# EAGLE design pc_openpressure_basic (EAGLE 6.4)
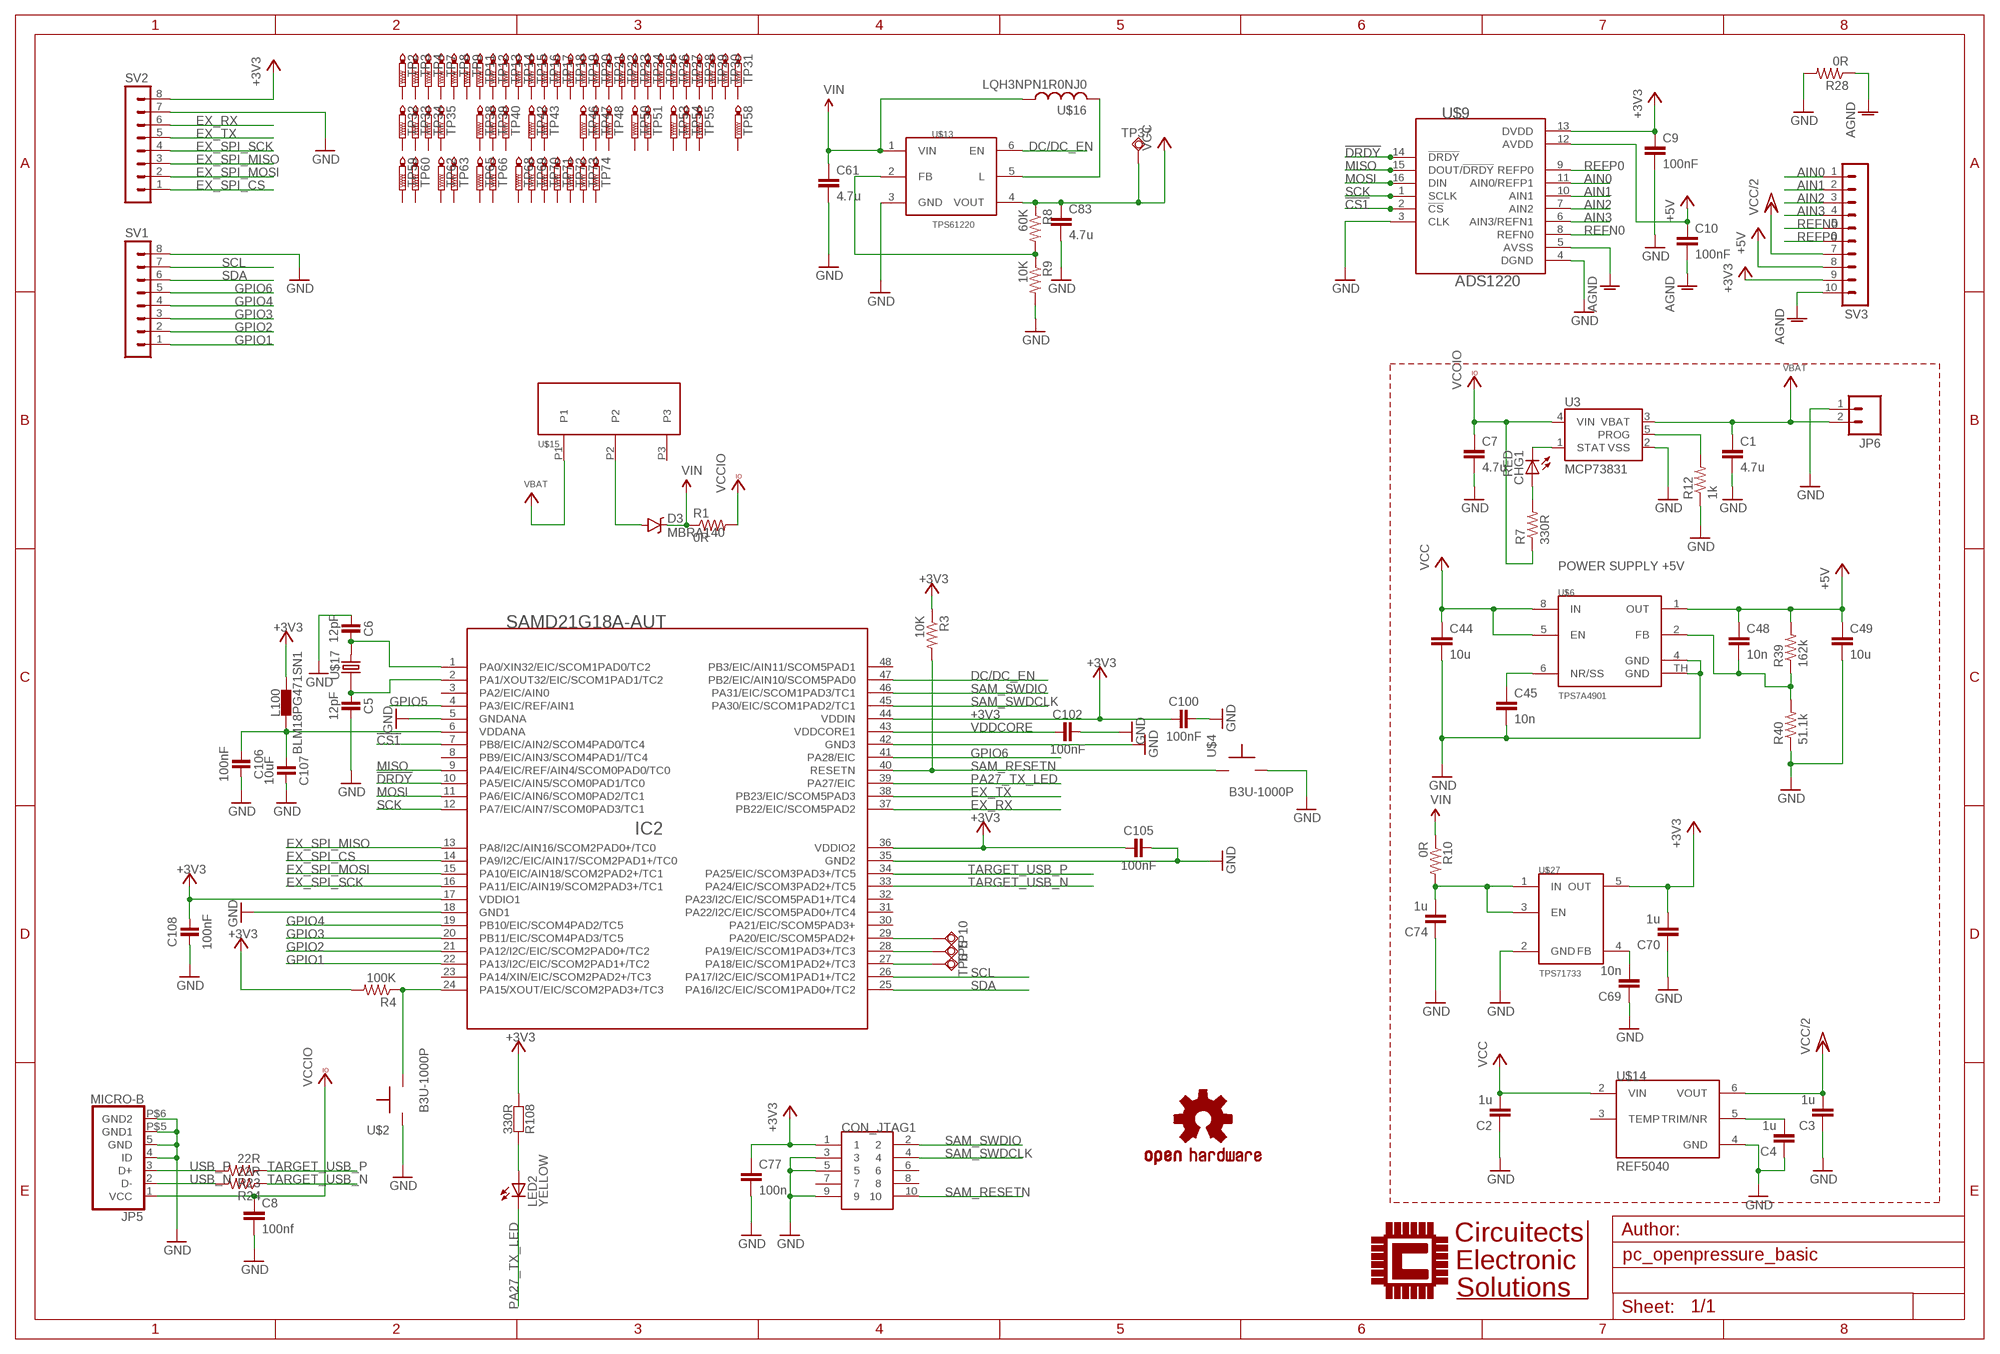
[diagram p0: schematic, sheet 1]

## Parts
C1  4.7u  C-EUC0805  [C0805]
C2  1u  C-EUC0805  [C0805]
C3  1u  C-EUC0805  [C0805]
C4  1u  C-EUC0805  [C0805]
C5  12pF  CAPACITORS-0402  [C0402]
C6  12pF  CAPACITORS-0402  [C0402]
C7  4.7u  C-EUC0805  [C0805]
C8  100nf  C-EUC0805  [C0805]
C9  100nF  C-EUC0805  [C0805]
C10  100nF  C-EUC0805  [C0805]
C44  10u  C-EUC0805  [C0805]
C45  10n  C-EUC0402  [C0402]
C48  10n  C-EUC0402  [C0402]
C49  10u  C-EUC0805  [C0805]
C61  4.7u  C-EUC0805  [C0805]
C69  10n  C-EUC0402  [C0402]
C70  1u  C-EUC0805  [C0805]
C74  1u  C-EUC0805  [C0805]
C77  100n  C-EUC0805  [C0805]
C83  4.7u  C-EUC0805  [C0805]
C100  100nF  CAPACITORS-0805  [C0805]
C102  100nF  CAPACITORS-0805  [C0805]
C105  100nF  CAPACITORS-0805  [C0805]
C106  100nF  CAPACITORS-0805  [C0805]
C107  10uF  CAPACITORS-0805  [C0805]
C108  100nF  CAPACITORS-0805  [C0805]
CHG1  RED  LEDCHIPLED_0603  [CHIPLED_0603]
CON_JTAG1  HDR-SMT-50MIL/5X2  [HDR-SMT-50MIL/5X2]
D3  MBRA140  DIODE-SCHOTTKY-MBRA140  [SMA-DIODE]
IC2  SAMD21G18A-AUT  SAMD21G18A  [TQFP48]
JP5  MICRO-B  [MICRO-B]
JP6  M02-JST-2MM-SMT  [JST-2-SMD]
L100  BLM18PG471SN1  INDUCTOR-0603  [C0603]
LED2  YELLOW  LEDCHIPLED_0603  [CHIPLED_0603]
R1  0R  R-US_R0402  [R0402]
R3  10K  R-US_R0805  [R0805]
R4  100K  R-US_R0402  [R0402]
R7  330R  R-US_R0805  [R0805]
R8  60K  R-US_R0805  [R0805]
R9  10K  R-US_R0805  [R0805]
R10  0R  R-US_R0402  [R0402]
R12  1k  R-US_R0805  [R0805]
R23  22R  R-US_R0402  [R0402]
R24  22R  R-US_R0402  [R0402]
R28  0R  R-US_R0805  [R0805]
R39  162k  R-US_R0805  [R0805]
R40  51.1k  R-US_R0805  [R0805]
R108  330R  RESISTORS-0402  [C0402]
SV1  MA08-1  [MA08-1]
SV2  MA08-1  [MA08-1]
SV3  MA10-1  [MA10-1]
TP2  PTR1PAD1-13  [P1-13]
TP3  PTR1PAD1-13  [P1-13]
TP4  PTR1PAD1-13  [P1-13]
TP5  TPSQB1,27  [B1,27]
TP6  TPSQB1,27  [B1,27]
TP7  PTR1PAD1-13  [P1-13]
TP8  PTR1PAD1-13  [P1-13]
TP9  PTR1PAD1-13  [P1-13]
TP10  TPSQB1,27  [B1,27]
TP11  PTR1PAD1-13  [P1-13]
TP12  PTR1PAD1-13  [P1-13]
TP13  PTR1PAD1-13  [P1-13]
TP14  PTR1PAD1-13  [P1-13]
TP15  PTR1PAD1-13  [P1-13]
TP16  PTR1PAD1-13  [P1-13]
TP17  PTR1PAD1-13  [P1-13]
TP18  PTR1PAD1-13  [P1-13]
TP19  PTR1PAD1-13  [P1-13]
TP20  PTR1PAD1-13  [P1-13]
TP21  PTR1PAD1-13  [P1-13]
TP22  PTR1PAD1-13  [P1-13]
TP23  PTR1PAD1-13  [P1-13]
TP24  PTR1PAD1-13  [P1-13]
TP25  PTR1PAD1-13  [P1-13]
TP26  PTR1PAD1-13  [P1-13]
TP27  PTR1PAD1-13  [P1-13]
TP28  PTR1PAD1-13  [P1-13]
TP29  PTR1PAD1-13  [P1-13]
TP30  PTR1PAD1-13  [P1-13]
TP31  PTR1PAD1-13  [P1-13]
TP32  PTR1PAD1-13  [P1-13]
TP33  PTR1PAD1-13  [P1-13]
TP34  PTR1PAD1-13  [P1-13]
TP35  PTR1PAD1-13  [P1-13]
TP37  TPSQB1,27  [B1,27]
TP38  PTR1PAD1-13  [P1-13]
TP39  PTR1PAD1-13  [P1-13]
TP40  PTR1PAD1-13  [P1-13]
TP42  PTR1PAD1-13  [P1-13]
TP43  PTR1PAD1-13  [P1-13]
TP46  PTR1PAD1-13  [P1-13]
TP47  PTR1PAD1-13  [P1-13]
TP48  PTR1PAD1-13  [P1-13]
TP50  PTR1PAD1-13  [P1-13]
TP51  PTR1PAD1-13  [P1-13]
TP53  PTR1PAD1-13  [P1-13]
TP54  PTR1PAD1-13  [P1-13]
TP55  PTR1PAD1-13  [P1-13]
TP58  PTR1PAD1-13  [P1-13]
TP59  PTR1PAD1-13  [P1-13]
TP60  PTR1PAD1-13  [P1-13]
TP62  PTR1PAD1-13  [P1-13]
TP63  PTR1PAD1-13  [P1-13]
TP65  PTR1PAD1-13  [P1-13]
TP66  PTR1PAD1-13  [P1-13]
TP68  PTR1PAD1-13  [P1-13]
TP69  PTR1PAD1-13  [P1-13]
TP70  PTR1PAD1-13  [P1-13]
TP71  PTR1PAD1-13  [P1-13]
TP72  PTR1PAD1-13  [P1-13]
TP73  PTR1PAD1-13  [P1-13]
TP74  PTR1PAD1-13  [P1-13]
U3  MCP73831  [SOT23-5]
U$2  B3U-1000P  [B3U-1000P]
U$4  B3U-1000P  [B3U-1000P]
U$6  TPS7A4901  [S-PDSO-G08]
U$7  CES-LOGO  [CES-LOGO-SMALL]
U$8  PROTY-LOGO  [LOGO-PROTY]
U$9  ADS1220  [TSSOP-16]
U$13  TPS61220  TPS61222  [SC-70-6]
U$14  REF5040  [SO-08M]
U$15  PCM12SMTR  [PCM12SMTR]
U$16  LQH3NPN1R0NJ0  [LQH3NP]
U$17  ECS-X-34B  [ECX-31B]
U$18  PROTY_LOGO_WITH_TEXT  [PROTY_WITH_TEXT]
U$19  OSHW-LOGOM  [OSHW-LOGO-M]
U$27  TPS71733  TPS717XX  [SC70-5]

## Nets
!CS1: IC2.7(PB8/EIC/AIN2/SCOM4PAD0/TC4) U$9.2(!CS)
!DRDY: IC2.10(PA5/EIC/AIN5/SCOM0PAD1/TC0) U$9.14(!DRDY)
+3V3: C9.1 C70.2 C77.1 C100.1 C105.1 C108.2 CON_JTAG1.1 IC2.17(VDDIO1) IC2.36(VDDIO2) IC2.44(VDDIN) L100.2 R3.1 R4.2 R108.1 SV2.8 SV3.9 U$9.13(DVDD) U$27.5(OUT)
+5V: C10.1 C48.1 C49.1 R39.2 SV3.8 U$6.1(OUT) U$9.12(AVDD)
AGND: C10.2 R28.1 SV3.10 U$9.5(AVSS)
AIN0: SV3.1 U$9.11(AIN0/REFP1)
AIN1: SV3.2 U$9.10(AIN1)
AIN2: SV3.3 U$9.7(AIN2)
AIN3: SV3.4 U$9.6(AIN3/REFN1)
DC/DC_EN: IC2.47(PB2/EIC/AIN10/SCOM5PAD0) U$13.6(EN)
EX_RX: IC2.37(PB22/EIC/SCOM5PAD2) SV2.6
EX_SPI_CS: IC2.14(PA9/I2C/EIC/AIN17/SCOM2PAD1+/TC0) SV2.1
EX_SPI_MISO: IC2.13(PA8/I2C/AIN16/SCOM2PAD0+/TC0) SV2.3
EX_SPI_MOSI: IC2.15(PA10/EIC/AIN18/SCOM2PAD2+/TC1) SV2.2
EX_SPI_SCK: IC2.16(PA11/EIC/AIN19/SCOM2PAD3+/TC1) SV2.4
EX_TX: IC2.38(PB23/EIC/SCOM5PAD3) SV2.5
GND [gnd]: C1.2 C2.1 C3.1 C4.1 C5.2 C6.1 C7.2 C8.2 C9.2 C44.2 C45.2 C49.2 C61.2 C69.1 C70.1 C74.1 C77.2 C83.2 C100.2 C102.2 C105.2 C106.2 C107.2 C108.1 CON_JTAG1.3 CON_JTAG1.5 CON_JTAG1.9 IC2.5(GNDANA) IC2.18(GND1) IC2.35(GND2) IC2.42(GND3) JP5.4(ID) JP5.5(GND) JP5.P$5(GND1) JP5.P$6(GND2) JP6.1 R9.2 R12.1 R28.2 R40.1 SV1.8 SV2.7 U3.2(VSS) U$2.P$1 U$4.P$2 U$6.4(GND) U$6.TH(GND) U$9.3(CLK) U$9.4(DGND) U$13.3(GND) U$14.4(GND) U$27.2(GND)
GPIO1: IC2.22(PA13/I2C/EIC/SCOM2PAD1+/TC2) SV1.1
GPIO2: IC2.21(PA12/I2C/EIC/SCOM2PAD0+/TC2) SV1.2
GPIO3: IC2.20(PB11/EIC/SCOM4PAD3/TC5) SV1.3
GPIO4: IC2.19(PB10/EIC/SCOM4PAD2/TC5) SV1.4
GPIO5: IC2.4(PA3/EIC/REF/AIN1)
GPIO6: IC2.41(PA28/EIC) SV1.5
MISO: IC2.9(PA4/EIC/REF/AIN4/SCOM0PAD0/TC0) U$9.15(DOUT/!DRDY)
MOSI: IC2.11(PA6/EIC/AIN6/SCOM0PAD2/TC1) U$9.16(DIN)
N$1: C6.2 IC2.1(PA0/XIN32/EIC/SCOM1PAD0/TC2) U$17.P$2
N$2: C74.2 R10.2 U$27.1(IN) U$27.3(EN)
N$4: D3.A U$15.P2
N$5: R8.2 R9.1 U$13.2(FB)
N$6: IC2.24(PA15/XOUT/EIC/SCOM2PAD3+/TC3) R4.1 U$2.P$2
N$7: C5.1 IC2.2(PA1/XOUT32/EIC/SCOM1PAD1/TC2) U$17.P$1
N$10: C106.1 C107.1 IC2.6(VDDANA) L100.1
N$11: IC2.27(PA18/EIC/SCOM1PAD2+/TC3) TP6.TP
N$14: CHG1.C U3.1(STAT)
N$15: CHG1.A R7.2
N$16: C45.1 U$6.6(NR/SS)
N$17: IC2.28(PA19/EIC/SCOM1PAD3+/TC3) TP5.TP
N$18: IC2.29(PA20/EIC/SCOM5PAD2+) TP10.TP
N$19: R12.2 U3.5(PROG)
N$20: LED2.A R108.2
N$21: C48.2 R39.1 R40.2 U$6.2(FB)
N$24: C4.2 U$14.5(TRIM/NR)
N$39: U$13.5(L) U$16.P$2
N$70: C69.2 U$27.4(FB)
PA27_TX_LED: IC2.39(PA27/EIC) LED2.C
REFN0: SV3.5 U$9.8(REFN0)
REFP0: SV3.6 U$9.9(REFP0)
SAM_RESETN: CON_JTAG1.10 IC2.40(RESETN) R3.2 U$4.P$1
SAM_SWDCLK: CON_JTAG1.4 IC2.45(PA30/EIC/SCOM1PAD2/TC1)
SAM_SWDIO: CON_JTAG1.2 IC2.46(PA31/EIC/SCOM1PAD3/TC1)
SCK: IC2.12(PA7/EIC/AIN7/SCOM0PAD3/TC1) U$9.1(SCLK)
SCL: IC2.26(PA17/I2C/EIC/SCOM1PAD1+/TC2) SV1.7
SDA: IC2.25(PA16/I2C/EIC/SCOM1PAD0+/TC2) SV1.6
TARGET_USB_N [USBpair]: IC2.33(PA24/EIC/SCOM3PAD2+/TC5) R24.1
TARGET_USB_P [USBpair]: IC2.34(PA25/EIC/SCOM3PAD3+/TC5) R23.1
USB_N [USBpair]: JP5.2(D-) R24.2
USB_P [USBpair]: JP5.3(D+) R23.2
VBAT: C1.1 JP6.2 U3.3(VBAT) U$15.P1
VCC: C2.2 C44.1 C83.1 R8.1 TP37.TP U$6.5(EN) U$6.8(IN) U$13.4(VOUT) U$14.2(VIN)
VCC/2: C3.2 SV3.7 U$14.6(VOUT)
VCCIO: C7.1 C8.1 JP5.1(VCC) R1.2 R7.1 U3.4(VIN)
VDDCORE: C102.1 IC2.43(VDDCORE1)
VIN: C61.1 D3.C R1.1 R10.1 U$13.1(VIN) U$16.P$1
Unconnected: CON_JTAG1.6 CON_JTAG1.7 CON_JTAG1.8 IC2.3(PA2/EIC/AIN0) IC2.8(PB9/EIC/AIN3/SCOM4PAD1//TC4) IC2.23(PA14/XIN/EIC/SCOM2PAD2+/TC3) IC2.30(PA21/EIC/SCOM5PAD3+) IC2.31(PA22/I2C/EIC/SCOM5PAD0+/TC4) IC2.32(PA23/I2C/EIC/SCOM5PAD1+/TC4) IC2.48(PB3/EIC/AIN11/SCOM5PAD1) TP2.TP TP3.TP TP4.TP TP7.TP TP8.TP TP9.TP TP11.TP TP12.TP TP13.TP TP14.TP TP15.TP TP16.TP TP17.TP TP18.TP TP19.TP TP20.TP TP21.TP TP22.TP TP23.TP TP24.TP TP25.TP TP26.TP TP27.TP TP28.TP TP29.TP TP30.TP TP31.TP TP32.TP TP33.TP TP34.TP TP35.TP TP38.TP TP39.TP TP40.TP TP42.TP TP43.TP TP46.TP TP47.TP TP48.TP TP50.TP TP51.TP TP53.TP TP54.TP TP55.TP TP58.TP TP59.TP TP60.TP TP62.TP TP63.TP TP65.TP TP66.TP TP68.TP TP69.TP TP70.TP TP71.TP TP72.TP TP73.TP TP74.TP U$14.3(TEMP) U$15.P3

## Notes on the sheet
- POWER SUPPLY +5V

## Library data of the parts
C1-C4 C7-C10 C44 C45 C48 C49 C61 C69 C70 C74 C77 C83 = rcl:C-EU: CAPACITOR, European symbol
C5 C6 C100 C102 C105-C108 = Arduino:CAPACITORS: Capacitors ...4.7uF @ 6.3V -> 0402 ...10uF @ 16V -> 0603 ...22uF @ 25V -> 0805
CHG1 LED2 = led:LED: LED OSRAM: - CHIPLED LG R971, LG N971, LY N971, LG Q971, LY Q971, LO R971, LY R971 LH N974, LH R974 LS Q976, LO Q976, LY Q976 LO Q996 - Hyper CHIPLED LW Q18S LB Q993, LB Q99A, LB R99A - SideLED LS A670, LO A670, LY A670, LG A670, LP A670 LB A673, LV A673, LT A673, LW A673 LH A674 LY A675 LS A676, LA A676, LO A676, LY A676, LW A676 LS A679, LY A679, LG A679 - Hyper Micro SIDELED® LS Y876, LA Y876, LO Y876, LY Y876 LT Y87S - SmartLED LW L88C, LW L88S LB L89C, LB L89S, LG L890 LS L89K, LO L89K, LY L89K LS L896, LA L896, LO L896, LY L896 - TOPLED LS T670, LO T670, LY T670, LG T670, LP T670 LSG T670, LSP T670, LSY T670, LOP T670, LYG T670 LG T671, LOG T671, LSG T671 LB T673, LV T673, LT T673, LW T673 LH T674 LS T676, LA T676, LO T676, LY T676, LB T676, LH T676, LSB T676, LW T676 LB T67C, LV T67C, LT T67C, LS T67K, LO T67K, LY T67K, LW E67C LS E67B, LA E67B, LO E67B, LY E67B, LB E67C, LV E67C, LT E67C LW T67C LS T679, LY T679, LG T679 LS T770, LO T770, LY T770, LG T770, LP T770 LB T773, LV T773, LT T773, LW T773 LH T774 LS E675, LA E675, LY E675, LS T675 LS T776, LA T776, LO T776, LY T776, LB T776 LHGB T686 LT T68C, LB T68C - Hyper Mini TOPLED® LB M676 - Mini TOPLED Santana® LG M470 LS M47K, LO M47K, LY M47K Source: http://www.osram.convergy.de LUXEON: - LUMILED® LXK2-PW12-R00, LXK2-PW12-S00, LXK2-PW14-U00, LXK2-PW14-V00 LXK2-PM12-R00, LXK2-PM12-S00, LXK2-PM14-U00 LXK2-PE12-Q00, LXK2-PE12-R00, LXK2-PE12-S00, LXK2-PE14-T00, LXK2-PE14-U00 LXK2-PB12-K00, LXK2-PB12-L00, LXK2-PB12-M00, LXK2-PB14-N00, LXK2-PB14-P00, LXK2-PB14-Q00 LXK2-PR12-L00, LXK2-PR12-M00, LXK2-PR14-Q00, LXK2-PR14-R00 LXK2-PD12-Q00, LXK2-PD12-R00, LXK2-PD12-S00 LXK2-PH12-R00, LXK2-PH12-S00 LXK2-PL12-P00, LXK2-PL12-Q00, LXK2-PL12-R00 Source: www.luxeon.com KINGBRIGHT: KA-3528ASYC Source: www.kingbright.com
CON_JTAG1 = circuitects:HDR-SMT-50MIL/5X2
D3 = SparkFun-DiscreteSemi:DIODE-SCHOTTKY: Schottky diodes in SFE's production catalog BAT20J 1A 23V 0.62Vf RB751 120mA 40V 0.37Vf PMEG4005EJ 0.5A 40V 0.42Vf MBRA140 1A 40V 0.5Vf B340A 3A 40V SMA; PROD_ID: DIO-08053
IC2 = Arduino:SAMD21G18A: Atmel D21 32bit ARM Cortex-M0 microcontroller - 48 PIN TQFP 256KB flash memory + 32KB SRAM
JP5 = circuitects:MICRO-B
JP6 = SparkFun:M02: Header 2 Standard 2-pin 0.1" header. Use with straight break away headers (SKU : PRT-00116), right angle break away headers (PRT-00553), swiss pins (PRT-00743), machine pins (PRT-00117), and female headers (PRT-00115). Molex polarized connector foot print use with SKU : PRT-08233 with associated crimp pins and housings.
L100 = Arduino:INDUCTOR: Inductors
R1 R3 R4 R7-R10 R12 R23 R24 R28 R39 R40 = rcl:R-US_: RESISTOR, American symbol
R108 = Arduino:RESISTORS: Resistors all kinds in 0603 and 0402
SV1 SV2 = con-lstb:MA08-1: PIN HEADER; OC_FARNELL: unknown; OC_NEWARK: unknown
SV3 = con-lstb:MA10-1: PIN HEADER; OC_FARNELL: unknown; OC_NEWARK: unknown
TP2-TP4 TP7-TP9 TP11-TP35 TP38-TP40 TP42 TP43 TP46-TP48 TP50 TP51 TP53-TP55 TP58-TP60 TP62 TP63 TP65 TP66 TP68-TP74 = testpad:PTR1: TEST PIN
TP5 TP6 TP10 TP37 = testpad:TPSQ: Test pad
U3 = SparkFun:MCP73831: Microchip's MCP73831 Miniature single cell, fully integrated Li-Ion, Li-polymer charge management controller http://ww1.microchip.com/downloads/en/DeviceDoc/21984a.pdf
U$2 U$4 = circuitects:B3U-1000P
U$6 = circuitects:TPS7A4901
U$7 = circuitects:CES-LOGO
U$8 = circuitects:PROTY-LOGO
U$9 = circuitects:ADS1220
U$13 = circuitects:TPS61222
U$14 = circuitects:REF5040
U$15 = circuitects:PCM12SMTR
U$16 = circuitects:LQH3NPN1R0NJ0
U$17 = circuitects:ECS-X-34B
U$18 = circuitects:PROTY_LOGO_WITH_TEXT
U$19 = SparkFun:OSHW-LOGO: Open Source Hardware Logo This logo indicates the piece of hardware it is found on incorporates a OSHW license and/or adheres to the definition of open source hardware found here: http://freedomdefined.org/OSHW
U$27 = circuitects:TPS717XX

## Net classes
1 USB: width 0.102 mm, drill 0.1 mm
2 gnd: width 0.102 mm, drill 0.1 mm
3 usbvcc: width 0.102 mm, drill 0.1 mm, clearance 0.15 mm
4 USBpair: width 0.102 mm, drill 0.1 mm, clearance 0.15 mm to class 3

## Board
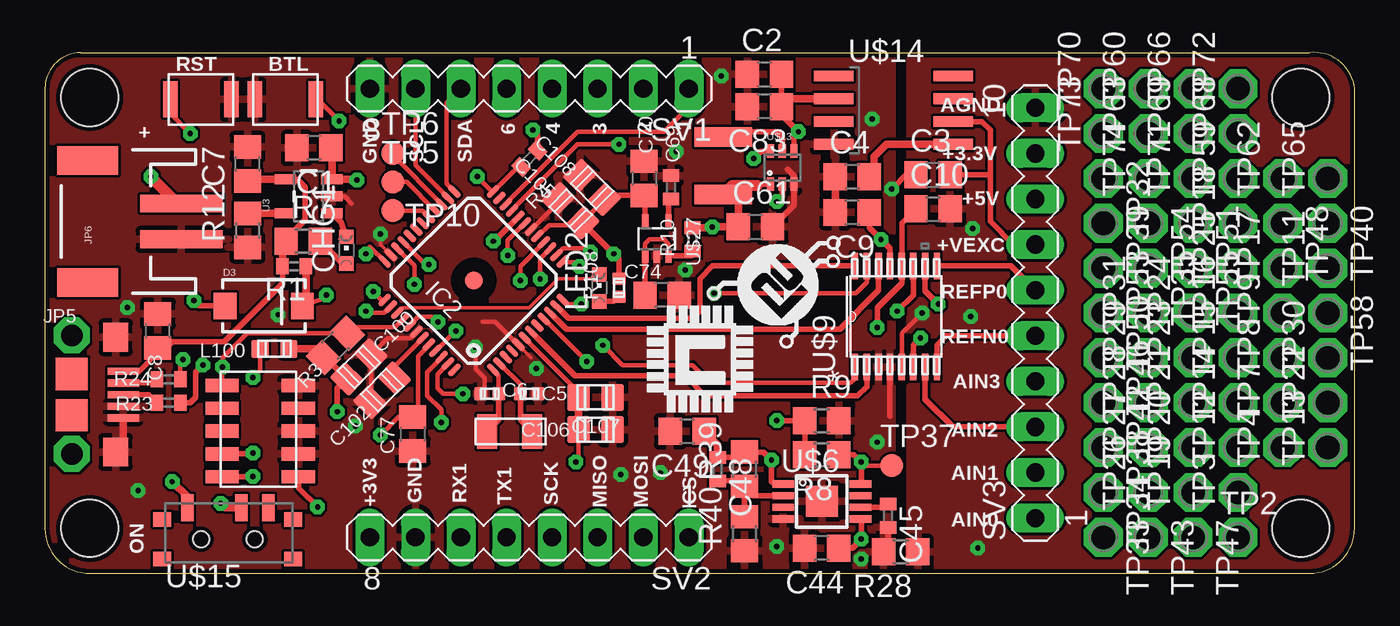
[diagram p1: board, top side]
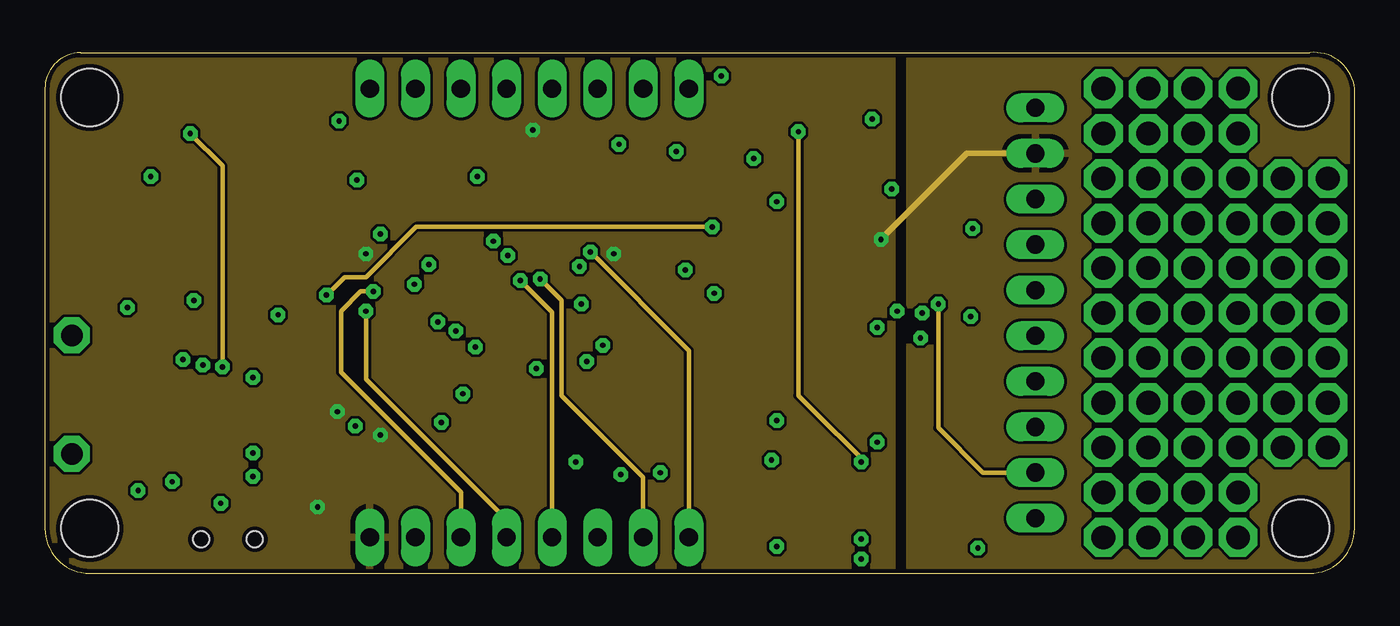
[diagram p2: board, inner layer Route2]
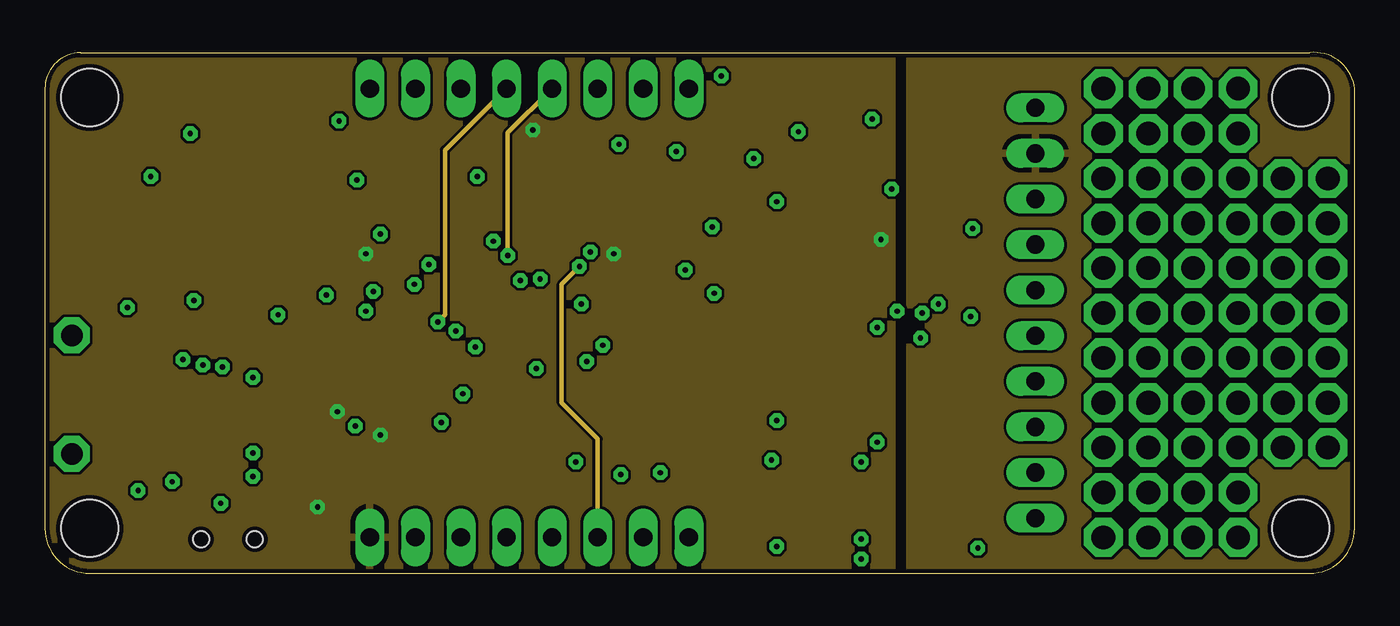
[diagram p3: board, inner layer Route15]
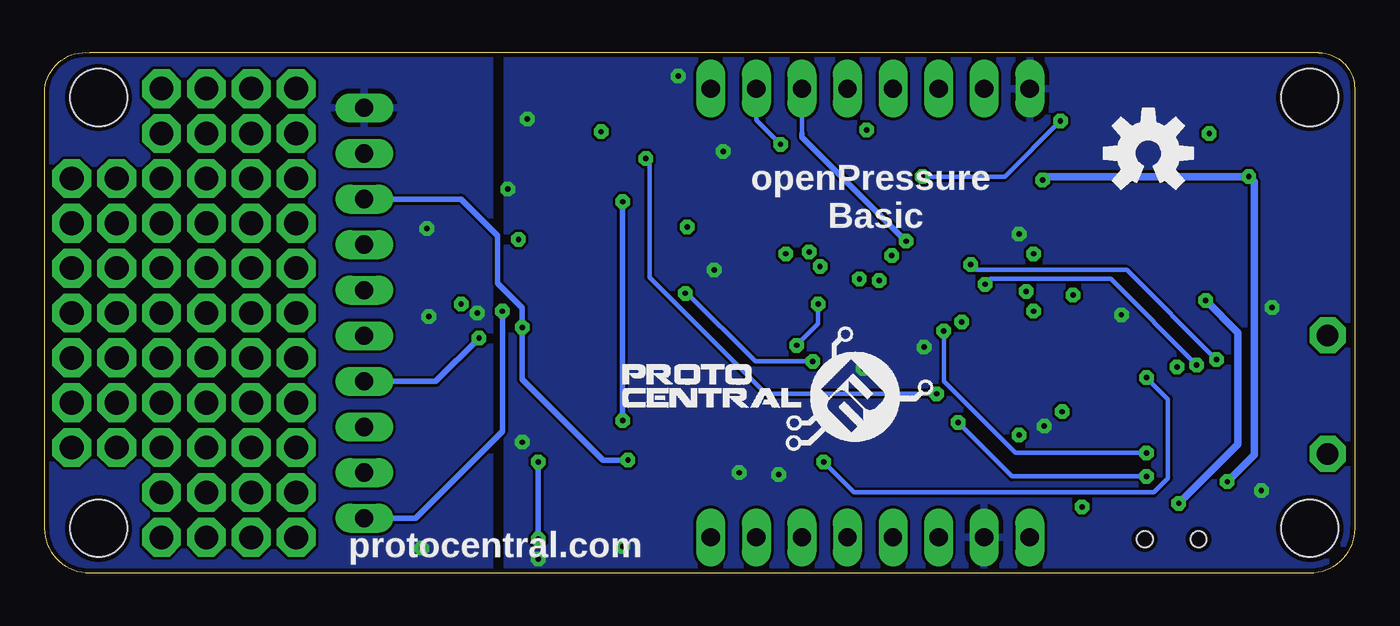
[diagram p4: board, bottom side, seen from below]

Size 73 x 29.01 mm. Coordinates in mm from the lower left corner, seen from the top.
Outline: 2.5,0 70.5,0 arc90 73,2.5 73,27 arc90 70.5,29 2,29 arc90 0,27 0,2.5 arc90 2.5,0
Copper layers (1*2*15*16): Top 0.035mm / dielectric 1.5mm / Route2 0.035mm / dielectric 0.15mm / Route15 0.035mm / dielectric 0.2mm / Bottom 0.035mm
Design rules "Circuitects-Rules": minimum track width 6mil, minimum drill 0.3mm, track to track 6mil, track to pad 6mil, pad to pad 6mil, via to via 6mil, smd to smd 6mil, copper to edge 10mil, drill to drill 8mil, minimum pad ring 12mil, minimum via ring 10mil, stop-mask expansion 4mil, vias tented up to drill 25mil, thermal gap 10mil
Holes 3.2 mm at 70,2.5 2.5,2.5 70,26.5 2.5,26.5

### Footprints (pad centres in the part's own frame; a part is rotated, then mirrored left to right if it is on the bottom)
C0805 = smd 1.3 x 1.5: 1 -0.95,0; 2 0.95,0
C0402 = smd 0.75 x 0.7: 1 0,0.5; 2 0,-0.5
C0402' = smd 0.7 x 0.9: 1 -0.65,0; 2 0.65,0
C0805' = smd 1.5 x 1.25: 1 0,0.95; 2 0,-0.95
CHIPLED_0603 = smd 0.8 x 0.8: A 0,-0.75; C 0,0.75
HDR-SMT-50MIL/5X2 = smd 0.74 x 1.85: 1 -2.54,-2.125; 2 -2.54,2.125; 3 -1.27,-2.125; 4 -1.27,2.125; 5 0,-2.125; 6 0,2.125; 7 1.27,-2.125; 8 1.27,2.125; 9 2.54,-2.125; 10 2.54,2.125
SMA-DIODE = smd 1.27 x 1.47: A -2.15,0; C 2.15,0
TQFP48 = smd 0.85 x 0.32: 1 -4.275,2.75; 2 -4.275,2.25; 3 -4.275,1.75; 4 -4.275,1.25; 5 -4.275,0.75; 6 -4.275,0.25; 7 -4.275,-0.25; 8 -4.275,-0.75; 9 -4.275,-1.25; 10 -4.275,-1.75; 11 -4.275,-2.25; 12 -4.275,-2.75; 25 4.275,-2.75; 26 4.275,-2.25; 27 4.275,-1.75; 28 4.275,-1.25; 29 4.275,-0.75; 30 4.275,-0.25; 31 4.275,0.25; 32 4.275,0.75; 33 4.275,1.25; 34 4.275,1.75; 35 4.275,2.25; 36 4.275,2.75 | smd 0.32 x 0.85: 13 -2.75,-4.275; 14 -2.25,-4.275; 15 -1.75,-4.275; 16 -1.25,-4.275; 17 -0.75,-4.275; 18 -0.25,-4.275; 19 0.25,-4.275; 20 0.75,-4.275; 21 1.25,-4.275; 22 1.75,-4.275; 23 2.25,-4.275; 24 2.75,-4.275; 37 2.75,4.275; 38 2.25,4.275; 39 1.75,4.275; 40 1.25,4.275; 41 0.75,4.275; 42 0.25,4.275; 43 -0.25,4.275; 44 -0.75,4.275; 45 -1.25,4.275; 46 -1.75,4.275; 47 -2.25,4.275; 48 -2.75,4.275 | smd 1 x 1: P$1 0,0
MICRO-B = smd 0.4 x 1.75: 1 -1.25,2.975; 2 -0.6,2.975; 3 0.05,2.975; 4 0.7,2.975; 5 1.35,2.975 | smd 1.8 x 1.8: P$1 -1.1,0.1; P$2 1.2,0.1 | drill 1.2 pad 2 octagon: P$3 -3.25,0.1; P$4 3.35,0.1 | smd 1.6 x 1.4: P$5 -3.15,2.55; P$6 3.25,2.55
JST-2-SMD = smd 1 x 4.6: 1 -1,-3.7; 2 1,-3.7 | smd 1.6 x 3.4: NC1 -3.4,1.5; NC2 3.4,1.5
C0603 = smd 1 x 0.95: 1 0,0.8; 2 0,-0.8
R0402 = smd 0.7 x 0.9: 1 -0.65,0; 2 0.65,0
R0805 = smd 1.3 x 1.5: 1 -0.95,0; 2 0.95,0
MA08-1 = drill 1.016 long: 1 -8.89,0; 2 -6.35,0; 3 -3.81,0; 4 -1.27,0; 5 1.27,0; 6 3.81,0; 7 6.35,0; 8 8.89,0
MA10-1 = drill 1.016 long: 1 -11.43,0; 2 -8.89,0; 3 -6.35,0; 4 -3.81,0; 5 -1.27,0; 6 1.27,0; 7 3.81,0; 8 6.35,0; 9 8.89,0; 10 11.43,0
P1-13 = drill 1.321 pad 2.159 octagon: TP 0,0
B1,27 = smd 1.27 x 1.27: TP 0,0
SOT23-5 = smd 0.55 x 1.2: 1 -0.95,-1.3; 2 0,-1.3; 3 0.95,-1.3; 4 0.95,1.3; 5 -0.95,1.3
B3U-1000P = smd 0.8 x 2: P$1 -1.7,0; P$2 1.7,0
S-PDSO-G08 = smd 0.4 x 1.2: 1 -0.975,-2.157; 2 -0.325,-2.157; 3 0.325,-2.157; 4 0.975,-2.157; 5 0.975,2.157; 6 0.325,2.157; 7 -0.325,2.157; 8 -0.975,2.157 | smd 1.73 x 1.78: TH 0,0
TSSOP-16 = smd 1.473 x 0.356: 1 -2.819,2.656; 2 -2.819,1.996; 3 -2.819,1.335; 4 -2.819,0.7; 5 -2.819,0.04; 6 -2.819,-0.595; 7 -2.819,-1.256; 8 -2.819,-1.916; 9 2.819,-1.916; 10 2.819,-1.256; 11 2.819,-0.595; 12 2.819,0.04; 13 2.819,0.7; 14 2.819,1.335; 15 2.819,1.996; 16 2.819,2.656
SC-70-6 = smd 0.4 x 0.75: 1 -0.65,-0.925; 2 0,-0.925; 3 0.65,-0.925; 4 0.65,0.925; 5 0,0.925; 6 -0.65,0.925
SO-08M = smd 0.6 x 2.2: 1 -1.905,-3.33; 2 -0.635,-3.33; 3 0.635,-3.33; 4 1.905,-3.33; 5 1.905,3.33; 6 0.635,3.33; 7 -0.635,3.33; 8 -1.905,3.33
PCM12SMTR = smd 0.7 x 1.5: P1 -2.25,1.75; P2 0.75,1.75; P3 2.25,1.75 | smd 1 x 0.8: P$1 -3.65,-1.1; P$2 3.65,-1.1; P$3 3.65,1.1; P$4 -3.65,1.1 | hole 0.9: -1.5,0; 1.5,0
LQH3NP = smd 1.1 x 3.2: P$1 -1.6,0; P$2 1.6,0
ECX-31B = smd 1.1 x 1.9: P$1 1.25,0; P$2 -1.25,0
SC70-5 = smd 0.35 x 0.8: 1 -0.65,-0.95; 2 0,-0.95; 3 0.65,-0.95; 4 0.65,0.95; 5 -0.65,0.95

### Placement (x,y rotation side)
C1  15,23.7 180 top
C2  40.1,27.8 0 top
C3  49.5,22.2 0 top
C4  45,22.1 0 top
C5  27,10 90 top
C6  24.8,10 90 top
C7  11.3,22.8 90 top
C8  6.3,13.5 90 top
C9  45,20.1 180 top
C10  49.5,20.3 0 top
C44  43.3,1.4 180 top
C45  10n  [C0402']  47,3.2 270 top
C48  10n  [C0402']  37.5,5.8 270 top
C49  35.8,7.9 180 top
C61  39.6,19.3 0 top
C69  10n  [C0402']  34.9,21.5 270 top
C70  33.4,22 270 top
C74  34.4,15.5 180 top
C77  20.5,7.76 270 top
C83  40.1,26 180 top
C100  100nF  [C0805']  17.5,11.5 135 top
C102  100nF  [C0805']  18.8,10.2 315 top
C105  100nF  [C0805']  29.3,20.2 225 top
C106  100nF  [C0805']  30.7,8 90 top
C107  10uF  [C0805']  30.7,9.8 90 top
C108  100nF  [C0805']  30.5,21.5 45 top
CHG1  16.8,18 0 top
CON_JTAG1  12.01,7.92 90 top
D3  12.2,14.9 0 top
IC2  23.9,16.3 135 top
JP5  1.4,10 270 top
JP6  3.9,19.6 90 top
L100  12.8,12.5 90 top
LED2  30.9,15.9 0 top
R1  13.9,17.1 180 top
R3  16.2,12.7 45 top
R4  27,23.1 45 top
R7  14.4,18.5 0 top
R8  43.3,6.6 180 top
R9  43.3,8.5 0 top
R10  36.1,18.6 270 top
R12  11.3,19.1 90 top
R23  6.9,9.5 180 top
R24  6.9,10.8 180 top
R28  47.7,1.2 180 top
R39  39,5.8 90 top
R40  39,2.2 90 top
R108  32,15.9 0 top
SV1  27,27 180 top
SV2  27,2 180 top
SV3  55.2,14.5 90 top
TP2  66.5,2 0 top
TP3  66.5,4.5 90 top
TP4  69,7 90 top
TP5  19.4,21.8 0 top
TP6  19.4,23.4 0 top
TP7  69,9.5 90 top
TP8  69,12 90 top
TP9  69,14.5 90 top
TP10  19.4,20.2 0 top
TP11  71.5,17 90 top
TP12  66.5,7 90 top
TP13  71.5,7 90 top
TP14  66.5,9.5 90 top
TP15  66.5,12 90 top
TP16  66.5,14.5 90 top
TP17  69,17 90 top
TP18  66.5,19.5 90 top
TP19  64,4.5 90 top
TP20  64,7 90 top
TP21  64,9.5 90 top
TP22  71.5,9.5 90 top
TP23  64,12 90 top
TP24  64,14.5 90 top
TP25  66.5,17 90 top
TP26  61.5,4.5 90 top
TP27  61.5,7 90 top
TP28  61.5,9.5 90 top
TP29  61.5,12 90 top
TP30  71.5,12 90 top
TP31  61.5,14.5 90 top
TP32  59,22 270 top
TP33  59,2 270 top
TP34  59,4.5 270 top
TP35  61.5,17 270 top
TP37  47.2,6 0 top
TP38  59,7 270 top
TP39  59,19.5 270 top
TP40  71.5,19.5 270 top
TP42  59,9.5 270 top
TP43  61.5,2 270 top
TP46  59,12 270 top
TP47  64,2 270 top
TP48  69,19.5 270 top
TP50  59,14.5 270 top
TP51  64,19.5 270 top
TP53  59,17 270 top
TP54  61.5,19.5 270 top
TP55  64,17 270 top
TP58  71.5,14.5 270 top
TP59  66.5,22 90 top
TP60  61.5,27 90 top
TP62  69,22 90 top
TP63  61.5,24.5 90 top
TP65  71.5,22 90 top
TP66  64,27 90 top
TP68  66.5,24.5 90 top
TP69  64,24.5 90 top
TP70  59,27 90 top
TP71  64,22 90 top
TP72  66.5,27 90 top
TP73  59,24.5 90 top
TP74  61.5,22 90 top
U3  14.7,21 90 top
U$2  13.4,26.4 0 top
U$4  8.7,26.4 0 top
U$6  43.3,4 270 top
U$7  33.5,8.9 0 top
U$8  44.4,18.9 180 top
U$9  47.8,14.3 90 top
U$13  41.1,22.6 0 top
U$14  47.3,25.8 270 top
U$15  10.2,1.9 0 top
U$16  37.8,22.7 90 top
U$17  25.9,7.9 0 top
U$18  41.9,6.8 0 bottom
U$19  11.5,23.4 0 bottom
U$27  34.11,18.64 0 top

### Tracks (layer width: path | path; a pad name or v marks a point on that pad's centre or on a via)
!CS1
  Top 0.305: IC2.7 29.55,11 35.7,11 36.8,9.9 45.3,9.9 45.8,10.4 U$9.2
!DRDY
  Top 0.305: IC2.10 29.07,13.6 44.3,13.6 46.47,15.77 U$9.14
+3V3  (via drill 0.3)
  Top 0.254: C108.2 C105.1 29.84,19.4 28.1,19.4 27.49,18.79 IC2.17 | IC2.44 21.41,12.71 20.8,12.1 20.8,9.01 C77.1 19.71,8.71 v18.7,7.7 | v17.9,17.8 18.11,18.2 IC2.36
  Top 0.305: R3.1 15.63,12.03 C100.1 16.3,10.3 v16.3,9 | CON_JTAG1.1 14.15,5.4 14.15,4.75 v15.2,3.7 | C105.1 30.07,19.43 v31.7,17.8 32,17.5 R108.1 | 33.46,21.09 C70.2 | 31.49,21.15 C108.2 31.39,21.05 C70.2 | R4.2 27.46,24.44 v27.2,24.7 | U$27.5 33.46,20.99 C70.2 | U$9.13 47.1,18.1 v46.6,18.6 45.95,19.25 C9.1
  Top 0.406: L100.2 15.06,12.5 R3.1
  Route2 0.305: SV3.9 51.39,23.39 v46.6,18.6
  pour Route15: 0,29 47.2,29 47.2,0 0,0
  pour Route2: 0,29 47.2,29 47.2,0 0,0
  pour Route2: 48.2,29 72.7,29 72.7,0 48.2,0
  pour Route15: 48.2,29 72.7,29 72.7,0 48.2,0
+5V  (via drill 0.3)
  Top 0.305: U$6.1 40.62,4.97 40.5,5.1 v40.5,6.3 40.05,6.75 R39.2 38.7,6.45 C48.1 | v46.4,13.7 46.4,14.8 47.76,16.16 U$9.12 47.76,19.51 C10.1
  Top 0.406: C48.1 37.5,7.15 C49.1
  Bottom 0.305: v40.5,6.3 41.9,6.3 46.4,10.8 v46.4,13.7 46.4,14.8 47.76,16.16 47.76,18.8 49.81,20.85 SV3.8
AGND  (via drill 0.3)
  Top 0.254: U$9.5 47.76,13.36 v48.9,14.5
  other vias: 52,1.4 51.7,19.2 51.6,14.3
  pour Top: 48.2,29 72.7,29 72.7,0 48.2,0
  pour Bottom: 48.2,29 72.7,29 72.7,0 48.2,0
AIN0  (via drill 0.3)
  Top 0.305: U$9.11 48.4,15.49 v47.5,14.6
  Bottom 0.305: v47.5,14.6 47.5,7.9 52.33,3.07 SV3.1
AIN1  (via drill 0.3)
  Top 0.305: U$9.10 49.06,15.74 v49.8,15
  Route2 0.254: v49.8,15 49.8,8.1 52.29,5.61 SV3.2
AIN2
  Top 0.305: U$9.7 49.06,9.69 50.6,8.15 SV3.3
AIN3  (via drill 0.3)
  Top 0.305: U$9.6 48.4,12.7 v48.8,13.1
  Bottom 0.305: SV3.4 51.21,10.69 v48.8,13.1
DC/DC_EN  (via drill 0.3)
  Top 0.254: IC2.47 22.47,11.67 21.9,11.1 21.9,10.3 22.2,10 v23.3,10
  Top 0.305: U$13.6 39.92,23.52 v39.5,23.1
  Bottom 0.254: v23.3,10 32.8,10 39.3,16.5 39.3,22.9 v39.5,23.1
EX_RX  (via drill 0.3)
  Top 0.254: IC2.37 18.78,15.22 v18.3,15.7
  Route2 0.254: SV2.6 23.19,4.51 16.5,11.2 16.5,14.6 17.6,15.7 v18.3,15.7
EX_SPI_CS  (via drill 0.3)
  Top 0.254: v30.4,17.9 30.2,18.1 28.88,18.1 IC2.14
  Route2 0.254: SV2.1 35.89,12.41 v30.4,17.9
EX_SPI_MISO  (via drill 0.3)
  Top 0.254: IC2.13 28.87,17.33 29.57,17.33 v29.8,17.1
  Route15 0.254: SV2.3 30.81,7.49 28.8,9.5 28.8,16.1 v29.8,17.1
EX_SPI_MOSI  (via drill 0.3)
  Top 0.254: 28.16,18.06 IC2.15 27.6,17.52 v27.6,16.4
  Route2 0.254: SV2.2 33.35,5.35 28.8,9.9 28.8,15.2 v27.6,16.4
EX_SPI_SCK  (via drill 0.3)
  Top 0.254: 27.84,18.44 IC2.16 27.81,18.41 26.5,17.1 v26.5,16.3
  Route2 0.254: SV2.4 28.27,14.53 v26.5,16.3
EX_TX  (via drill 0.3)
  Top 0.254: IC2.38 19.27,14.87 18.9,14.5 18,14.5 v17.9,14.6
  Route2 0.254: SV2.5 25.73,2.97 17.9,10.8 v17.9,14.6
GND  (via drill 0.3)
  Top 0.2: IC2.5 26.39,12.71 27.1,12 | IC2.35 19.27,17.73 18.7,18.3 v18.7,18.9
  Top 0.254: C105.2 28.43,20.48 IC2.18 | IC2.42 20.35,13.1 19.1,13.1 C100.2 18.17,9.57 C102.2 | IC2.5 26.35,12.75 25.1,14 24.4,14 | C6.1 24.5,10.2 24.5,10.9 24,11.4 v24,12.6 | U3.2 16.7,21 17.1,20.6
  Top 0.305: U$9.4 47.1,8.75 | 41.4,22.5 41.75,22.15 U$13.3 41.75,20.5 C61.2 | C3.1 48.1,22.3 v47.2,21.4 | C45.2 47,1.45 R28.2
  Top 0.406: JP5.5 4.38,7.17 JP5.P$6 | C4.1 C9.2
  other vias: 27.4,11.4 17.3,8.2 32.1,5.5 13,14.4 4.6,14.8 37.7,27.7 35.2,23.5 35.7,16.9 34.3,5.6 45.5,0.8 46.4,7.3 40.8,1.5 46.1,25.3 5.2,4.6
  pour Bottom: 0,0 0,29 47.2,29 47.2,0
  pour Top: 0,0 0,29 47.2,29 47.2,0
GPIO1
  Top 0.254: IC2.22 25.68,20.59 29.7,24.6 34.5,24.6 35.89,25.99 SV1.1
GPIO2  (via drill 0.3)
  Top 0.254: 26.01,20.21 IC2.21 26.04,20.24 29.7,23.9 v32,23.9
  Bottom 0.254: SV1.2 33.35,25.25 v32,23.9
GPIO3  (via drill 0.3)
  Top 0.254: 26.39,19.79 IC2.20 26.35,19.85
  Top 0.305: v25,18.5 25.04,18.5 IC2.20
  Bottom 0.254: 30.8,24.5 SV1.3
  Bottom 0.305: 30.8,24.5 30.8,24.3 v25,18.5
GPIO4  (via drill 0.3)
  Top 0.254: IC2.19 26.75,19.45 | IC2.19 26.7,19.5 | v25.8,17.7 25.8,18.55 IC2.19
  Route15 0.254: v25.8,17.7 25.8,24.53 SV1.4
GPIO6  (via drill 0.3)
  Top 0.254: IC2.41 20.35,13.85 20.8,14.3 21.6,14.3 v21.9,14
  Route15 0.254: v21.9,14 22.3,14.4 22.3,23.57 SV1.5
MISO  (via drill 0.3)
  Top 0.254: IC2.9 27.84,14.16 v30.2,11.8 | v37.3,15.6 45.2,15.6 45.8,16.2 U$9.15
  Bottom 0.254: v37.3,15.6 37.2,15.6 33.4,11.8 v30.2,11.8
MOSI
  Top 0.305: IC2.11 29.18,14.2 36.1,14.2 36.5,14.6 36.5,16.4 37.22,17.12 U$9.16
N$1
  Top 0.254: C6.2 25.3,11.01 IC2.1
  Top 0.305: C6.2 25.3,8.55 U$17.P$2
N$2
  Top 0.254: U$27.1 33.46,18.36 33.7,18.6 34.5,18.6 34.76,18.34 U$27.3
  Top 0.305: U$27.1 33.46,16.19 C74.2 | U$27.3 36.04,17.69 R10.2
N$4  (via drill 0.3)
  Top 0.305: D3.A 8.6,14.9 v8.3,15.2
  Top 0.406: U$15.P2 10.05,3.65 v9.8,3.9 | 8.4,15.3 v8.3,15.2
  Bottom 0.406: v9.8,3.9 6.5,7.2 6.5,13.4 v8.3,15.2
N$5  (via drill 0.3)
  Top 0.305: R8.2 R9.1 v40.8,8.5 | U$13.2 41.1,21 v40.8,20.7
  Bottom 0.305: v40.8,8.5 v40.8,20.7
N$6  (via drill 0.3)
  Top 0.254: R4.1 26.14,22.43 IC2.24 24.93,21.27 v24.1,22.1 | U$2.P$2 15.2,26.4 v16.4,25.2
  Bottom 0.254: v24.1,22.1 19.5,22.1 v16.4,25.2
N$7
  Top 0.254: C5.1 26.5,10.52 IC2.2
  Top 0.305: C5.1 26.5,8.55 U$17.P$1
N$10  (via drill 0.3)
  Top 0.254: IC2.6 29.75,10.1 C107.1 | C106.1 29.75,6.35 v29.6,6.2 | L100.1 12,11.3 v11.6,10.9
  Top 0.406: C107.1 C106.1
  Bottom 0.254: v29.6,6.2 27.9,4.5 11.2,4.5 10.4,5.3 10.4,9.7 v11.6,10.9
N$11
  Top 0.254: TP6.TP 19.4,23.27 IC2.27
N$14
  Top 0.305: CHG1.C 16.5,19.55 U3.1
N$15
  Top 0.305: CHG1.A 16.6,17.25 R7.2
N$16
  Top 0.305: U$6.6 46.77,3.67 C45.1
N$17
  Top 0.254: TP5.TP 20.17,21.8 IC2.28
N$18
  Top 0.254: TP10.TP 21.06,20.2 IC2.29
N$19
  Top 0.406: U3.5 R12.2
N$20
  Top 0.305: LED2.A 31.7,15.15 R108.2
N$21
  Top 0.305: U$6.2 39.52,4.33 R39.1 | R40.2 R39.1 | C48.2 38.7,5.15 R39.1
N$24
  Top 0.406: U$14.5 46.9,23.89 46.2,23.2 46.2,22.35 C4.2
N$39
  Top 0.305: U$13.5 41.1,24.3 40.8,24.6 38.1,24.6 U$16.P$2
N$70
  Top 0.305: U$27.4 34.76,20.71 C69.2
PA27_TX_LED
  Top 0.2: IC2.39 19.93,14.8 27,14.8 28.6,16.4 30.55,16.4 LED2.C
REFN0
  Top 0.305: SV3.5 50.23,13.23 49.72,12.72 U$9.8
REFP0
  Top 0.305: U$9.9 53.85,17.12 SV3.6
SAM_RESETN  (via drill 0.3)
  Top 0.254: R3.2 17.17,13.37 | IC2.40 19.96,14.16 19.5,13.7 17.2,13.7 R3.2 | 9.9,10.47 CON_JTAG1.10 9.88,11.48 v9.9,11.5 9.9,12 11.27,13.37 R3.2 | U$4.P$1 7,25.6 v8.1,24.5
  Route2 0.254: v9.9,11.5 9.9,22.7 v8.1,24.5
SAM_SWDCLK  (via drill 0.3)
  Top 0.254: IC2.45 21.79,12.39 v22.9,13.5
  Top 0.305: CON_JTAG1.4 11.55,6.65 v11.6,6.7
  Bottom 0.254: v22.9,13.5 22.9,10.7 18.9,6.7 v11.6,6.7
SAM_SWDIO  (via drill 0.3)
  Top 0.254: IC2.46 22.11,12.02 21.3,11.2 21.3,9.9 22.1,9.1 v22.1,8.4
  Top 0.305: CON_JTAG1.2 11.58,5.38 v11.6,5.4
  Bottom 0.254: v11.6,5.4 19.1,5.4 v22.1,8.4
SCK  (via drill 0.3)
  Top 0.254: v29.9,15 29.09,15 IC2.12 | v31.1,12.7 32.2,11.6 36.1,11.6 37.1,10.6 44.9,10.6 45.14,10.84 U$9.1
  Bottom 0.254: v29.9,15 29.9,13.9 v31.1,12.7
SCL
  Top 0.254: 22.47,20.93 IC2.26 20.65,22.73 SV1.7
SDA
  Top 0.254: IC2.25 22.4,21.7 22.4,26.21 SV1.6
TARGET_USB_N  (via drill 0.3)
  Top 0.254: R24.1 7.55,11.75 v7.7,11.9 | v21.4,17.2 21.23,17.2 IC2.33
  Bottom 0.254: v7.7,11.9 12.7,16.9 21.1,16.9 v21.4,17.2
TARGET_USB_P  (via drill 0.3)
  Top 0.254: v20.6,16.1 20.6,17.12 IC2.34
  Top 0.305: R23.1 8.1,9.5 8.4,9.8 8.4,11.2 v8.8,11.6
  Bottom 0.254: v8.8,11.6 13.6,16.4 20.3,16.4 v20.6,16.1
USB_N
  Top 0.305: JP5.2 6.05,10.6 R24.2
USB_P
  Top 0.305: JP5.3 5.8,9.95 R23.2
VBAT  (via drill 0.3)
  Top 0.406: C1.1 16,23.65 U3.3 17.35,21.95 v17.4,21.9 | U$15.P1 7.95,4.25 v7.1,5.1
  Top 0.61: JP6.2 7.4,20.6 v5.9,22.1
  Bottom 0.406: v17.4,21.9 17.2,22.1 v5.9,22.1 5.6,21.8 5.6,6.6 v7.1,5.1
VCC  (via drill 0.3)
  Top 0.254: TP37.TP 45.7,6 v45.5,6.2
  Top 0.305: C44.1 45,1.4 v45.5,1.9 45.5,2.98 U$6.5 | R8.1 45.1,6.6 v45.5,6.2 45.5,5.02 U$6.8 | C2.2 C83.1 41.05,25.55 v42,24.6 41.75,24.35 U$13.4
  Top 0.406: U$14.2 41.48,26.43 C83.1
  Route2 0.254: v45.5,6.2 45.5,6.4 42.85,9.05 42.6,9.3 42,9.9 v42,24.6
  Bottom 0.305: v45.5,6.2 v45.5,1.9
VCC/2
  Top 0.305: U$14.6 52.23,25.16 52.7,24.7 52.7,22.2 | 52.7,22.2 52.7,19.6 53.99,18.31 SV3.7 | C3.2 52.7,22.2
VCCIO
  Top 0.305: JP5.1 5.25,11.25 6.3,12.3 C8.1 6.75,12.55 7.1,12.9 10,12.9 13.25,16.15 R1.2 | U3.4 14.05,21.95 14.5,21.5 14.5,19.7 13.45,18.65 R7.1
  Top 0.406: U3.4 11.4,21.95 C7.1 | R1.2 13.25,18.3 R7.1
VDDCORE
  Top 0.254: C102.1 19.47,11.52 IC2.43
VIN  (via drill 0.3)
  Top 0.254: D3.C 15.5,15.3 v15.7,15.5
  Top 0.305: U$13.1 39.77,21.68 39.7,21.6
  Top 0.406: U$16.P$1 38.7,21.1 38.65,21.05 C61.1 v37.2,19.3 37.25,19.25 R10.1 | R1.1 14.55,15.1 D3.C
  Top 0.61: 39.7,21.6 38.3,21.6 U$16.P$1
  Route2 0.254: v15.7,15.5 16.7,16.5 17.9,16.5 20.7,19.3 v37.2,19.3

### Text on the board
tPlace: RST | BTL | AGND | + | 6 | 4 | 3 | 2 | 1 | GND | SCL | SDA | +3.3V | +5V | +VEXC | REFP0 | REFN0 | AIN3 | AIN2 | MISO | MOSI | CS | AIN1 | +3V3 | GND | RX1 | TX1 | SCK | ON | AIN0
bPlace: openPressure / Basic | protocentral.com